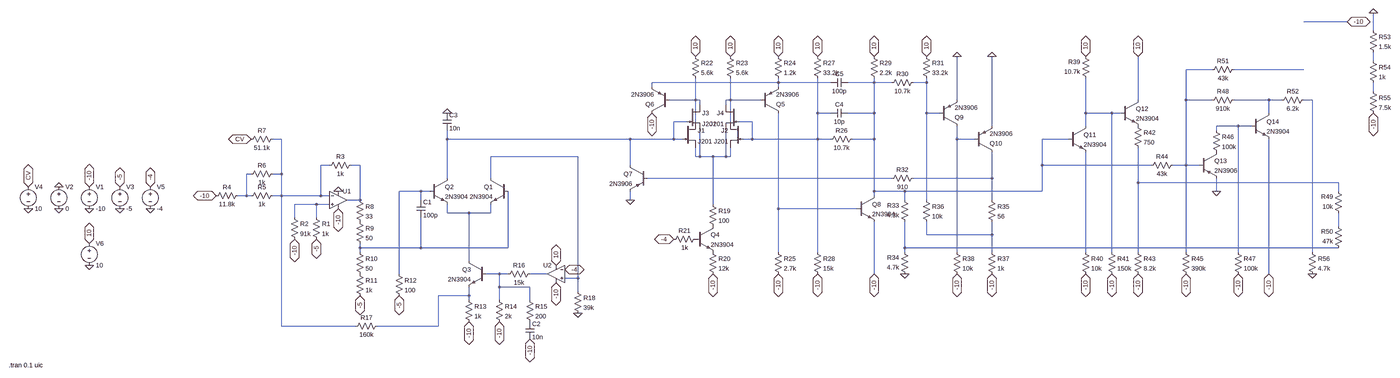
[diagram p0: schematic MOD D.asc, whole sheet]
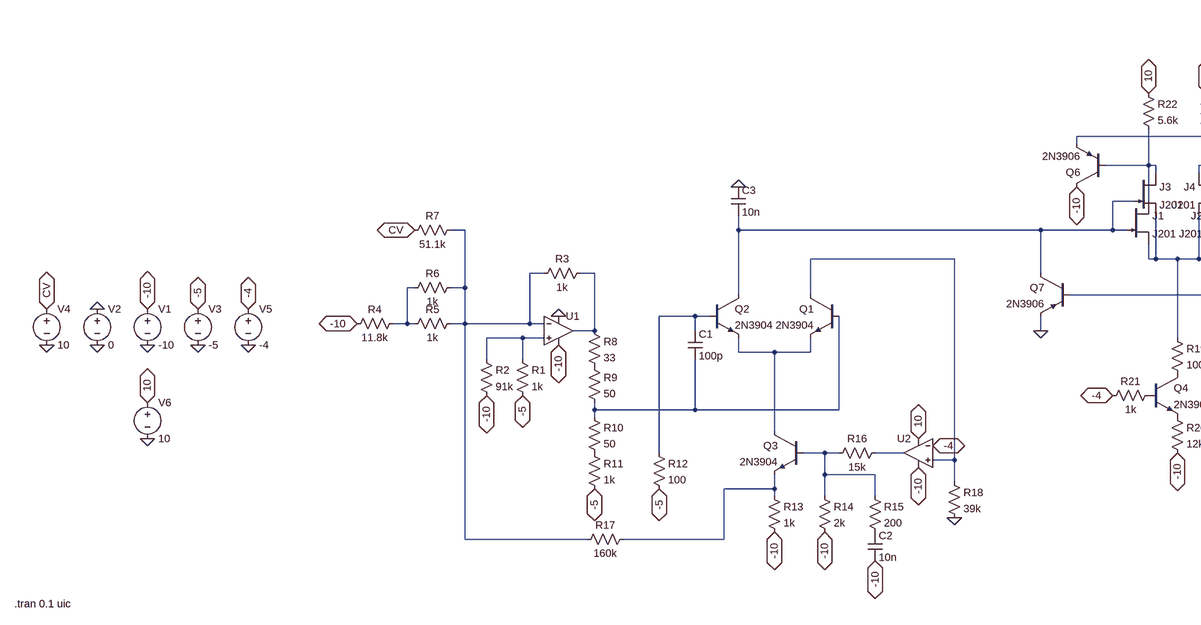
[diagram p1: schematic MOD D.asc, part, row 1 of 1, column 1 of 2]
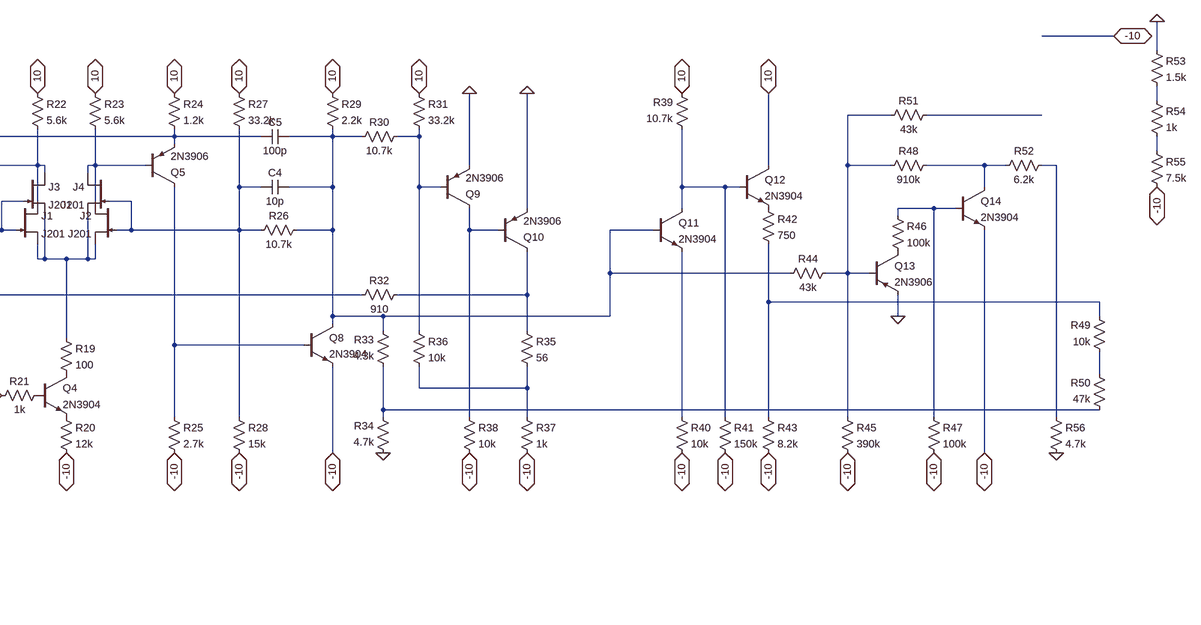
[diagram p2: schematic MOD D.asc, part, row 1 of 1, column 2 of 2]
MOD D.asc, the LTspice schematic file:
Version 4
SHEET 1 4152 800
WIRE 3984 -480 3824 -480
WIRE 4080 -448 4080 -512
WIRE 4080 -336 4080 -368
WIRE 3488 -304 3392 -304
WIRE 3824 -304 3568 -304
WIRE 1872 -256 1872 -272
WIRE 1872 -256 1408 -256
WIRE 2064 -256 1872 -256
WIRE 2224 -256 2224 -272
WIRE 2224 -256 2128 -256
WIRE 2288 -256 2224 -256
WIRE 2416 -256 2416 -272
WIRE 2416 -256 2368 -256
WIRE 1408 -240 1408 -256
WIRE 1872 -240 1872 -256
WIRE 4080 -224 4080 -256
WIRE 1568 -192 1568 -272
WIRE 1568 -192 1472 -192
WIRE 1584 -192 1568 -192
WIRE 1696 -192 1696 -272
WIRE 1696 -192 1680 -192
WIRE 1808 -192 1696 -192
WIRE 2528 -192 2528 -352
WIRE 3216 -192 3216 -352
WIRE 3392 -192 3392 -304
WIRE 3488 -192 3392 -192
WIRE 3696 -192 3568 -192
WIRE 3744 -192 3696 -192
WIRE 3856 -192 3824 -192
WIRE 1584 -176 1584 -192
WIRE 1680 -176 1680 -192
WIRE 2016 -144 2016 -272
WIRE 2064 -144 2016 -144
WIRE 2224 -144 2224 -256
WIRE 2224 -144 2128 -144
WIRE 2416 -144 2416 -256
WIRE 2464 -144 2416 -144
WIRE 3024 -144 3024 -272
WIRE 3120 -144 3024 -144
WIRE 3152 -144 3120 -144
WIRE 3696 -144 3696 -192
WIRE 1536 -112 1488 -112
WIRE 1568 -112 1568 -192
WIRE 1696 -112 1696 -192
WIRE 1776 -112 1728 -112
WIRE 2656 -96 2656 -352
WIRE 3024 -96 3024 -144
WIRE 3584 -96 3504 -96
WIRE 3632 -96 3584 -96
WIRE 3504 -80 3504 -96
WIRE 48 -48 16 -48
WIRE 656 -48 656 -80
WIRE 1328 -48 656 -48
WIRE 1488 -48 1488 -112
WIRE 1488 -48 1328 -48
WIRE 1520 -48 1488 -48
WIRE 1776 -48 1776 -112
WIRE 1776 -48 1744 -48
WIRE 2016 -48 2016 -144
WIRE 2016 -48 1776 -48
WIRE 2064 -48 2016 -48
WIRE 2224 -48 2224 -144
WIRE 2224 -48 2144 -48
WIRE 2528 -48 2528 -96
WIRE 2592 -48 2528 -48
WIRE 2960 -48 2864 -48
WIRE 1136 16 816 16
WIRE 1568 16 1568 -16
WIRE 1584 16 1584 -80
WIRE 1584 16 1568 16
WIRE 1632 16 1584 16
WIRE 1680 16 1680 -80
WIRE 1680 16 1632 16
WIRE 1696 16 1696 -16
WIRE 1696 16 1680 16
WIRE 224 48 192 48
WIRE 336 48 304 48
WIRE 1328 48 1328 -48
WIRE 2864 48 2864 -48
WIRE 3264 48 2864 48
WIRE 3392 48 3392 -192
WIRE 3392 48 3344 48
WIRE 3440 48 3392 48
WIRE -64 80 -80 80
WIRE 48 80 48 -48
WIRE 48 80 16 80
WIRE 656 96 656 -48
WIRE 816 96 816 16
WIRE 2288 96 1392 96
WIRE 2656 96 2656 0
WIRE 2656 96 2368 96
WIRE 3216 112 3216 -16
WIRE 3952 112 3216 112
WIRE 560 144 480 144
WIRE 592 144 560 144
WIRE 2224 144 2224 -48
WIRE 2336 144 2224 144
WIRE 2864 144 2864 48
WIRE 2864 144 2336 144
WIRE 3504 144 3504 96
WIRE 3952 144 3952 112
WIRE -80 160 -80 80
WIRE -80 160 -112 160
WIRE -64 160 -80 160
WIRE 48 160 48 80
WIRE 48 160 16 160
WIRE 192 160 192 48
WIRE 192 160 48 160
WIRE 224 160 192 160
WIRE 2224 160 2224 144
WIRE 336 176 336 48
WIRE 336 176 288 176
WIRE 560 176 560 144
WIRE 1328 176 1328 144
WIRE 2336 176 2336 144
WIRE 2416 176 2416 -144
WIRE 2656 176 2656 96
WIRE 176 192 96 192
WIRE 224 192 176 192
WIRE 1632 192 1632 16
WIRE 1872 208 1872 -144
WIRE 2160 208 1872 208
WIRE 656 224 656 192
WIRE 736 224 656 224
WIRE 816 224 816 192
WIRE 816 224 736 224
WIRE 96 240 96 192
WIRE 176 240 176 192
WIRE 3952 272 3952 224
WIRE 2416 304 2416 256
WIRE 2656 304 2656 256
WIRE 2656 304 2416 304
WIRE 336 352 336 336
WIRE 560 352 560 240
WIRE 560 352 336 352
WIRE 880 352 880 144
WIRE 880 352 560 352
WIRE 2336 352 2336 256
WIRE 3952 352 2336 352
WIRE 336 368 336 352
WIRE 1872 368 1872 208
WIRE 2016 368 2016 -48
WIRE 2336 368 2336 352
WIRE 2528 368 2528 -48
WIRE 2656 368 2656 304
WIRE 3024 368 3024 0
WIRE 3120 368 3120 -144
WIRE 3216 368 3216 112
WIRE 3392 368 3392 48
WIRE 3584 368 3584 -96
WIRE 3856 368 3856 -192
WIRE 736 400 736 224
WIRE 480 448 480 144
WIRE 848 448 800 448
WIRE 880 448 848 448
WIRE 1024 448 960 448
WIRE 2224 448 2224 256
WIRE 3696 448 3696 -48
WIRE 1136 464 1136 16
WIRE 1136 464 1088 464
WIRE 848 496 848 448
WIRE 960 496 848 496
WIRE 1136 512 1136 464
WIRE 736 528 736 496
WIRE 736 528 624 528
WIRE 736 544 736 528
WIRE 848 544 848 496
WIRE 960 544 960 496
WIRE 48 640 48 160
WIRE 320 640 48 640
WIRE 624 640 624 528
WIRE 624 640 400 640
FLAG 256 208 -10
IOPIN 256 208 BiDir
FLAG 256 144 0
IOPIN 256 144 BiDir
FLAG -816 208 0
FLAG -928 208 0
FLAG -816 128 -10
IOPIN -816 128 BiDir
FLAG -928 128 0
IOPIN -928 128 BiDir
FLAG -704 208 0
FLAG -704 128 -5
IOPIN -704 128 BiDir
FLAG 176 320 -5
IOPIN 176 320 BiDir
FLAG 96 320 -10
IOPIN 96 320 BiDir
FLAG -192 160 -10
IOPIN -192 160 BiDir
FLAG -1040 208 0
FLAG -1040 128 CV
IOPIN -1040 128 BiDir
FLAG -64 -48 CV
IOPIN -64 -48 BiDir
FLAG 336 528 -5
IOPIN 336 528 BiDir
FLAG 480 528 -5
IOPIN 480 528 BiDir
FLAG 736 624 -10
IOPIN 736 624 BiDir
FLAG 848 624 -10
IOPIN 848 624 BiDir
FLAG 960 688 -10
IOPIN 960 688 BiDir
FLAG -592 208 0
FLAG -592 128 -4
IOPIN -592 128 BiDir
FLAG 1056 480 -10
IOPIN 1056 480 BiDir
FLAG -816 416 0
FLAG -816 336 10
IOPIN -816 336 BiDir
FLAG 1056 416 10
IOPIN 1056 416 BiDir
FLAG 1136 592 0
FLAG 1088 432 -4
IOPIN 1088 432 BiDir
FLAG 656 -144 0
FLAG 1632 448 -10
IOPIN 1632 448 BiDir
FLAG 1488 320 -4
IOPIN 1488 320 BiDir
FLAG 1568 -352 10
IOPIN 1568 -352 BiDir
FLAG 1696 -352 10
IOPIN 1696 -352 BiDir
FLAG 1872 -352 10
IOPIN 1872 -352 BiDir
FLAG 1408 -144 -10
IOPIN 1408 -144 BiDir
FLAG 1328 176 0
FLAG 1872 448 -10
IOPIN 1872 448 BiDir
FLAG 2016 -352 10
IOPIN 2016 -352 BiDir
FLAG 2016 448 -10
IOPIN 2016 448 BiDir
FLAG 2224 448 -10
IOPIN 2224 448 BiDir
FLAG 2224 -352 10
IOPIN 2224 -352 BiDir
FLAG 2416 -352 10
IOPIN 2416 -352 BiDir
FLAG 2528 -352 0
FLAG 2656 -352 0
FLAG 2336 448 0
FLAG 2528 448 -10
IOPIN 2528 448 BiDir
FLAG 2656 448 -10
IOPIN 2656 448 BiDir
FLAG 3024 -352 10
IOPIN 3024 -352 BiDir
FLAG 3216 -352 10
IOPIN 3216 -352 BiDir
FLAG 3024 448 -10
IOPIN 3024 448 BiDir
FLAG 3120 448 -10
IOPIN 3120 448 BiDir
FLAG 3216 448 -10
IOPIN 3216 448 BiDir
FLAG 3392 448 -10
IOPIN 3392 448 BiDir
FLAG 3504 144 0
FLAG 3584 448 -10
IOPIN 3584 448 BiDir
FLAG 3696 448 -10
IOPIN 3696 448 BiDir
FLAG 4080 -144 -10
IOPIN 4080 -144 BiDir
FLAG 4080 -512 0
FLAG 3984 -480 -10
IOPIN 3984 -480 BiDir
FLAG 3856 448 0
SYMBOL Opamps\\UniversalOpamp2 256 176 R0
SYMATTR InstName U1
SYMBOL voltage -816 112 R0
SYMATTR InstName V1
SYMATTR Value -10
SYMBOL voltage -928 112 R0
SYMATTR InstName V2
SYMATTR Value 0
SYMBOL voltage -704 112 R0
SYMATTR InstName V3
SYMATTR Value -5
SYMBOL res 160 224 R0
SYMATTR InstName R1
SYMATTR Value 1k
SYMBOL res 80 224 R0
SYMATTR InstName R2
SYMATTR Value 91k
SYMBOL res 320 32 R90
WINDOW 0 0 56 VBottom 2
WINDOW 3 32 56 VTop 2
SYMATTR InstName R3
SYMATTR Value 1k
SYMBOL res -96 144 R90
WINDOW 0 0 56 VBottom 2
WINDOW 3 32 56 VTop 2
SYMATTR InstName R4
SYMATTR Value 11.8k
SYMBOL res 32 144 R90
WINDOW 0 0 56 VBottom 2
WINDOW 3 32 56 VTop 2
SYMATTR InstName R5
SYMATTR Value 1k
SYMBOL res 32 64 R90
WINDOW 0 0 56 VBottom 2
WINDOW 3 32 56 VTop 2
SYMATTR InstName R6
SYMATTR Value 1k
SYMBOL res 32 -64 R90
WINDOW 0 0 56 VBottom 2
WINDOW 3 32 56 VTop 2
SYMATTR InstName R7
SYMATTR Value 51.1k
SYMBOL voltage -1040 112 R0
SYMATTR InstName V4
SYMATTR Value 10
SYMBOL res 320 160 R0
SYMATTR InstName R8
SYMATTR Value 33
SYMBOL res 320 240 R0
SYMATTR InstName R9
SYMATTR Value 50
SYMBOL res 320 352 R0
SYMATTR InstName R10
SYMATTR Value 50
SYMBOL res 320 432 R0
SYMATTR InstName R11
SYMATTR Value 1k
SYMBOL npn 880 96 M0
SYMATTR InstName Q1
SYMATTR Value 2N3904
SYMBOL npn 592 96 R0
SYMATTR InstName Q2
SYMATTR Value 2N3904
SYMBOL cap 544 176 R0
SYMATTR InstName C1
SYMATTR Value 100p
SYMBOL res 464 432 R0
SYMATTR InstName R12
SYMATTR Value 100
SYMBOL npn 800 400 M0
SYMATTR InstName Q3
SYMATTR Value 2N3904
SYMBOL res 720 528 R0
SYMATTR InstName R13
SYMATTR Value 1k
SYMBOL res 832 528 R0
SYMATTR InstName R14
SYMATTR Value 2k
SYMBOL res 944 528 R0
SYMATTR InstName R15
SYMATTR Value 200
SYMBOL cap 944 624 R0
SYMATTR InstName C2
SYMATTR Value 10n
SYMBOL res 976 432 R90
WINDOW 0 0 56 VBottom 2
WINDOW 3 32 56 VTop 2
SYMATTR InstName R16
SYMATTR Value 15k
SYMBOL res 416 624 R90
WINDOW 0 0 56 VBottom 2
WINDOW 3 32 56 VTop 2
SYMATTR InstName R17
SYMATTR Value 160k
SYMBOL voltage -592 112 R0
SYMATTR InstName V5
SYMATTR Value -4
SYMBOL Opamps\\UniversalOpamp2 1056 448 M0
SYMATTR InstName U2
SYMBOL voltage -816 320 R0
SYMATTR InstName V6
SYMATTR Value 10
SYMBOL res 1120 496 R0
SYMATTR InstName R18
SYMATTR Value 39k
SYMBOL cap 640 -144 R0
SYMATTR InstName C3
SYMATTR Value 10n
SYMBOL njf 1520 -112 R0
SYMATTR InstName J1
SYMATTR Value J201
SYMBOL njf 1744 -112 M0
SYMATTR InstName J2
SYMATTR Value J201
SYMBOL res 1616 176 R0
SYMATTR InstName R19
SYMATTR Value 100
SYMBOL npn 1568 272 R0
SYMATTR InstName Q4
SYMATTR Value 2N3904
SYMBOL res 1616 352 R0
SYMATTR InstName R20
SYMATTR Value 12k
SYMBOL res 1584 304 R90
WINDOW 0 0 56 VBottom 2
WINDOW 3 32 56 VTop 2
SYMATTR InstName R21
SYMATTR Value 1k
SYMBOL res 1552 -368 R0
SYMATTR InstName R22
SYMATTR Value 5.6k
SYMBOL res 1680 -368 R0
SYMATTR InstName R23
SYMATTR Value 5.6k
SYMBOL res 1856 -368 R0
SYMATTR InstName R24
SYMATTR Value 1.2k
SYMBOL pnp 1808 -144 M180
SYMATTR InstName Q5
SYMATTR Value 2N3906
SYMBOL pnp 1472 -144 R180
SYMATTR InstName Q6
SYMATTR Value 2N3906
SYMBOL pnp 1392 48 M0
SYMATTR InstName Q7
SYMATTR Value 2N3906
SYMBOL res 1856 352 R0
SYMATTR InstName R25
SYMATTR Value 2.7k
SYMBOL npn 2160 160 R0
SYMATTR InstName Q8
SYMATTR Value 2N3904
SYMBOL res 2160 -64 R90
WINDOW 0 0 56 VBottom 2
WINDOW 3 32 56 VTop 2
SYMATTR InstName R26
SYMATTR Value 10.7k
SYMBOL cap 2128 -160 R90
WINDOW 0 0 32 VBottom 2
WINDOW 3 32 32 VTop 2
SYMATTR InstName C4
SYMATTR Value 10p
SYMBOL cap 2128 -272 R90
WINDOW 0 0 32 VBottom 2
WINDOW 3 32 32 VTop 2
SYMATTR InstName C5
SYMATTR Value 100p
SYMBOL res 2000 -368 R0
SYMATTR InstName R27
SYMATTR Value 33.2k
SYMBOL res 2000 352 R0
SYMATTR InstName R28
SYMATTR Value 15k
SYMBOL res 2208 -368 R0
SYMATTR InstName R29
SYMATTR Value 2.2k
SYMBOL res 2384 -272 R90
WINDOW 0 0 56 VBottom 2
WINDOW 3 32 56 VTop 2
SYMATTR InstName R30
SYMATTR Value 10.7k
SYMBOL res 2400 -368 R0
SYMATTR InstName R31
SYMATTR Value 33.2k
SYMBOL pnp 2464 -96 M180
SYMATTR InstName Q9
SYMATTR Value 2N3906
SYMBOL pnp 2592 0 M180
SYMATTR InstName Q10
SYMATTR Value 2N3906
SYMBOL res 2384 80 R90
WINDOW 0 0 56 VBottom 2
WINDOW 3 32 56 VTop 2
SYMATTR InstName R32
SYMATTR Value 910
SYMBOL res 2352 272 R180
WINDOW 0 36 76 Left 2
WINDOW 3 36 40 Left 2
SYMATTR InstName R33
SYMATTR Value 4.3k
SYMBOL res 2352 464 R180
WINDOW 0 36 76 Left 2
WINDOW 3 36 40 Left 2
SYMATTR InstName R34
SYMATTR Value 4.7k
SYMBOL res 2640 160 R0
SYMATTR InstName R35
SYMATTR Value 56
SYMBOL res 2400 160 R0
SYMATTR InstName R36
SYMATTR Value 10k
SYMBOL res 2640 352 R0
SYMATTR InstName R37
SYMATTR Value 1k
SYMBOL res 2512 352 R0
SYMATTR InstName R38
SYMATTR Value 10k
SYMBOL npn 2960 -96 R0
SYMATTR InstName Q11
SYMATTR Value 2N3904
SYMBOL npn 3152 -192 R0
SYMATTR InstName Q12
SYMATTR Value 2N3904
SYMBOL res 3040 -256 R180
WINDOW 0 36 76 Left 2
WINDOW 3 36 40 Left 2
SYMATTR InstName R39
SYMATTR Value 10.7k
SYMBOL res 3008 352 R0
SYMATTR InstName R40
SYMATTR Value 10k
SYMBOL res 3104 352 R0
SYMATTR InstName R41
SYMATTR Value 150k
SYMBOL res 3200 -112 R0
SYMATTR InstName R42
SYMATTR Value 750
SYMBOL res 3200 352 R0
SYMATTR InstName R43
SYMATTR Value 8.2k
SYMBOL res 3360 32 R90
WINDOW 0 0 56 VBottom 2
WINDOW 3 32 56 VTop 2
SYMATTR InstName R44
SYMATTR Value 43k
SYMBOL res 3376 352 R0
SYMATTR InstName R45
SYMATTR Value 390k
SYMBOL pnp 3440 0 R0
SYMATTR InstName Q13
SYMATTR Value 2N3906
SYMBOL npn 3632 -144 R0
SYMATTR InstName Q14
SYMATTR Value 2N3904
SYMBOL res 3488 -96 R0
SYMATTR InstName R46
SYMATTR Value 100k
SYMBOL res 3568 352 R0
SYMATTR InstName R47
SYMATTR Value 100k
SYMBOL res 3584 -208 R90
WINDOW 0 0 56 VBottom 2
WINDOW 3 32 56 VTop 2
SYMATTR InstName R48
SYMATTR Value 910k
SYMBOL res 3968 240 R180
WINDOW 0 36 76 Left 2
WINDOW 3 36 40 Left 2
SYMATTR InstName R49
SYMATTR Value 10k
SYMBOL res 3968 368 R180
WINDOW 0 36 76 Left 2
WINDOW 3 36 40 Left 2
SYMATTR InstName R50
SYMATTR Value 47k
SYMBOL res 3584 -320 R90
WINDOW 0 0 56 VBottom 2
WINDOW 3 32 56 VTop 2
SYMATTR InstName R51
SYMATTR Value 43k
SYMBOL res 3840 -208 R90
WINDOW 0 0 56 VBottom 2
WINDOW 3 32 56 VTop 2
SYMATTR InstName R52
SYMATTR Value 6.2k
SYMBOL res 4064 -464 R0
SYMATTR InstName R53
SYMATTR Value 1.5k
SYMBOL res 4064 -352 R0
SYMATTR InstName R54
SYMATTR Value 1k
SYMBOL res 4064 -240 R0
SYMATTR InstName R55
SYMATTR Value 7.5k
SYMBOL res 3840 352 R0
SYMATTR InstName R56
SYMATTR Value 4.7k
SYMBOL njf 1536 -176 R0
SYMATTR InstName J3
SYMATTR Value J201
SYMBOL njf 1728 -176 M0
SYMATTR InstName J4
SYMATTR Value J201
TEXT -1112 784 Left 2 !.tran 0.1 uic

The netlist it stands for:
* MOD D.asc
XU1 N026 N016 0 -10 N020 level.2 Avol=1Meg GBW=10Meg Slew=10Meg ilimit=25m rail=0 Vos=0 phimargin=45 en=0 enk=0 in=0 ink=0 Rin=500Meg  ; pins IN+ IN- V+ V- OUT
V1 -10 0 -10
V2 0 0 0
V3 -5 0 -5
R1 N026 -5 1k
R2 N026 -10 91k
R3 N020 N016 1k
R4 N021 -10 11.8k
R5 N016 N021 1k
R6 N016 N021 1k
R7 N016 CV 51.1k
V4 CV 0 10
R8 N020 P001 33
R9 P001 N031 50
R10 N031 P002 50
R11 P002 -5 1k
Q1 N018 N031 N028 0 2N3904
Q2 N014 N025 N028 0 2N3904
C1 N025 N031 100p
R12 N025 -5 100
Q3 N028 N034 N036 0 2N3904
R13 N036 -10 1k
R14 N034 -10 2k
R15 N034 P003 200
C2 P003 -10 10n
R16 N035 N034 15k
R17 N036 N016 160k
V5 -4 0 -4
XU2 N018 -4 10 -10 N035 level.2 Avol=1Meg GBW=10Meg Slew=10Meg ilimit=25m rail=0 Vos=0 phimargin=45 en=0 enk=0 in=0 ink=0 Rin=500Meg  ; pins IN+ IN- V+ V- OUT
V6 10 0 10
R18 N018 0 39k
C3 0 N014 10n
J1 N008 N014 N019 J201
J2 N009 N012 N019 J201
R19 N019 P004 100
Q4 P004 P005 P006 0 2N3904
R20 P006 -10 12k
R21 P005 -4 1k
R22 10 N008 5.6k
R23 10 N009 5.6k
R24 10 N004 1.2k
Q5 N027 N009 N004 0 2N3906
Q6 -10 N008 N004 0 2N3906
Q7 N014 N022 0 0 2N3906
R25 N027 -10 2.7k
Q8 N005 N027 -10 0 2N3904
R26 N005 N012 10.7k
C4 N005 N012 10p
C5 N005 N004 100p
R27 10 N012 33.2k
R28 N012 -10 15k
R29 10 N005 2.2k
R30 N006 N005 10.7k
R31 10 N006 33.2k
Q9 N017 N006 0 0 2N3906
Q10 N023 N017 0 0 2N3906
R32 N023 N022 910
R33 N032 N005 4.3k
R34 0 N032 4.7k
R35 N023 N030 56
R36 N006 N030 10k
R37 N030 -10 1k
R38 N017 -10 10k
Q11 N013 N005 N033 0 2N3904
Q12 10 N013 P007 0 2N3904
R39 N013 10 10.7k
R40 N033 -10 10k
R41 N013 -10 150k
R42 P007 N024 750
R43 N024 -10 8.2k
R44 N002 N005 43k
R45 N002 -10 390k
Q13 P008 N002 0 0 2N3906
Q14 N010 N015 -10 0 2N3904
R46 N015 P008 100k
R47 N015 -10 100k
R48 N010 N002 910k
R49 N029 N024 10k
R50 N032 N029 47k
R51 N003 N002 43k
R52 N011 N010 6.2k
R53 0 N001 1.5k
R54 N001 N007 1k
R55 N007 -10 7.5k
R56 N011 0 4.7k
J3 N008 N014 N019 J201
J4 N009 N012 N019 J201
.model NPN NPN
.model PNP PNP
.lib standard.bjt
.model NJF NJF
.model PJF PJF
.lib standard.jft
.tran 0.1 uic
.lib UniversalOpamps2.sub
.backanno
.end